# Altium project BIOWOLF.PrjPcb
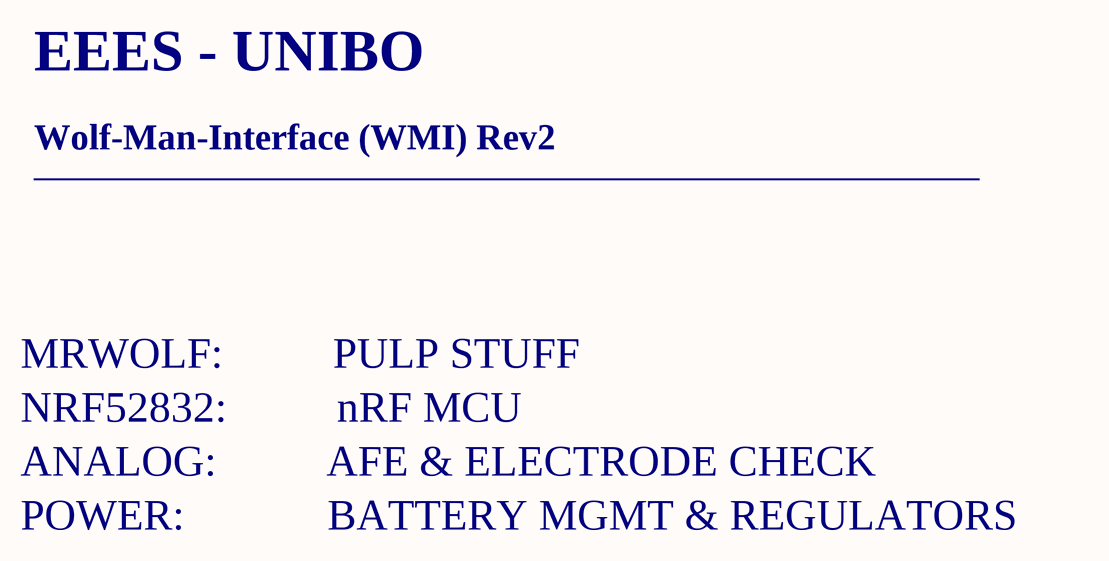
[diagram p0: 00_Cover.SchDoc]
7 sheets, 169 parts. Net scope: flat (ports and power ports of the same name join across sheets).
Board file: WOLFMAN.PcbDoc
Sheets:
  00_Cover.SchDoc
  01_MRWOLF.SchDoc
  02_NRF52832.SchDoc
  03_ANALOG_A.SchDoc
  04_ANALOG_B.SchDoc
  05_POWER.SchDoc
  06_SENSORS.SchDoc

## Sheet 00_Cover.SchDoc
size A4

### Notes on the sheet
- EEES - UNIBO
- Wolf-Man-Interface (WMI) Rev2
- ___________________________________________
- MRWOLF:          PULP STUFF
- NRF52832:          nRF MCU
- ANALOG:          AFE & ELECTRODE CHECK
- POWER:             BATTERY MGMT & REGULATORS

## Sheet 01_MRWOLF.SchDoc: WMI (MR.WOLF)
size A4; Author: MARCO; DrawnBy: MARCO; ProjectName: WOLF-MAN-INTERFACE
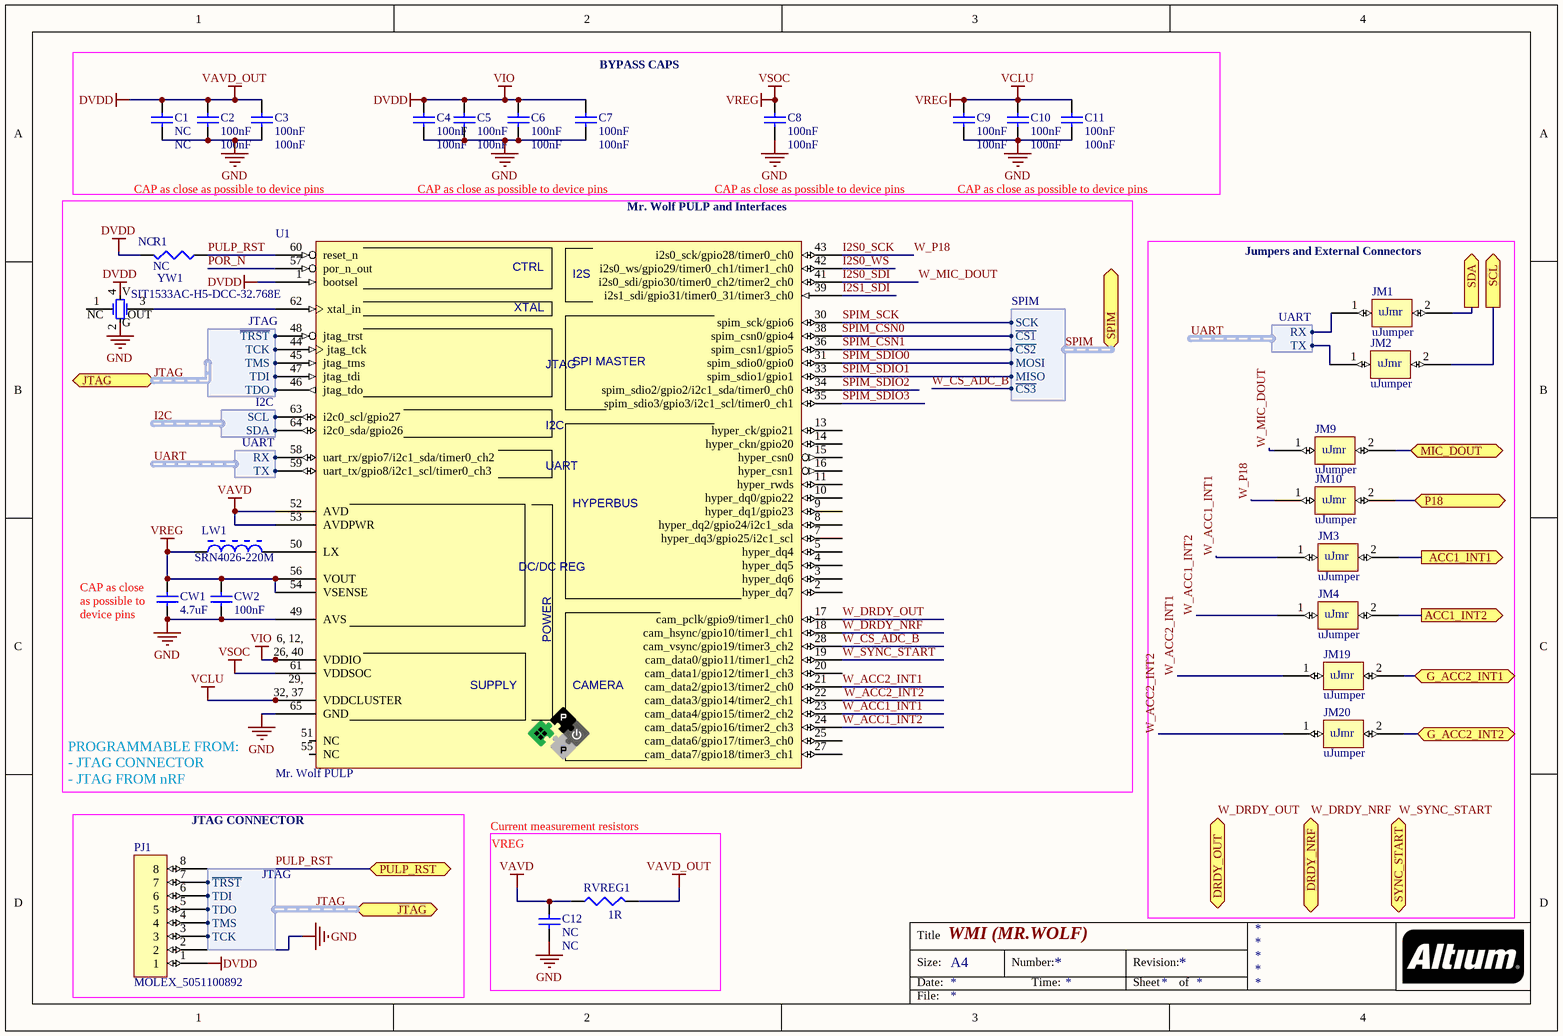
[diagram p1: 01_MRWOLF.SchDoc]

### Parts
C1  NC  [J1-0603]
C2  100nF  [0402]
C3  100nF  [0402]
C4  100nF  [0402]
C5  100nF  [0402]
C6  100nF  [0402]
C7  100nF  [0402]
C8  100nF  [0402]
C9  100nF  [0402]
C10  100nF  [0402]
C11  100nF  [0402]
C12  NC  [J1-0603]
CW1  4.7uF  [0402]
CW2  100nF  [0402]
JM1  uJumper  [UJMPR]
JM2  uJumper  [UJMPR]
JM3  uJumper  [UJMPR]
JM4  uJumper  [UJMPR]
JM9  uJumper  [UJMPR]
JM10  uJumper  [UJMPR]
JM19  uJumper  [UJMPR]
JM20  uJumper  [UJMPR]
LW1  SRN4026-220M  [1212_PCK]
PJ1  MOLEX_5051100892  [MOLEX_5051100892]
R1  NC  [0402]
RVREG1  value 1R  [J1-0603]
U1  Mr. Wolf PULP  [QFN50P900X900X100_HS_NOVIAS_65M]
YW1  SIT1533AC-H5-DCC-32.768E  [SiT1533-C]

### Blocks framed on the sheet
BYPASS CAPS: C1-C11
Mr. Wolf PULP and Interfaces: CW1 CW2 LW1 R1 U1 YW1
Jumpers and External Connectors: JM1-JM4 JM9 JM10 JM19 JM20
JTAG CONNECTOR: PJ1

### Ports
ACC1_INT1 (out), ACC1_INT2 (out), DRDY_NRF (bidir), DRDY_OUT (bidir), G_ACC2_INT1 (bidir), G_ACC2_INT2 (bidir), JTAG (harness JTAG), MIC_DOUT (bidir), P18 (bidir), PULP_RST (bidir), SCL (out), SDA (out), SPIM (harness SPIM), SYNC_START (bidir)

### Harnesses
JTAG: ~{TRST}, TCK, TMS, TDI, TDO
I2C: SCL, SDA
UART: RX, TX
SPIM: SCK, ~{CS1}, ~{CS2}, MOSI, MISO, ~{CS3}

### Nets
DVDD: C1.2 C2.2 C3.2 C4.2 C5.2 C6.2 C7.2 PJ1.1 R1.2 RVREG1.2 U1.1(bootsel) U1.6(VDDIO) U1.12(VDDIO) U1.26(VDDIO) U1.40(VDDIO) YW1.4(VDD)  [also labelled VAVD_OUT, VIO]
GND: C1.1 C2.1 C3.1 C4.1 C5.1 C6.1 C7.1 C8.1 C9.1 C10.1 C11.1 C12.1 CW1.1 CW2.1 PJ1.2 U1.49(AVS) U1.65(GND) YW1.2(GND)  [project net DGND]
VAVD: C12.2 RVREG1.1 U1.52(AVD) U1.53(AVDPWR)
VCLU: C8.2 C9.2 C10.2 C11.2 CW1.2 CW2.2 LW1.1 U1.29(VDDCLUSTER) U1.32(VDDCLUSTER) U1.37(VDDCLUSTER) U1.54(VSENSE) U1.56(VOUT) U1.61(VDDSOC)  [also labelled VREG, VSOC]
I2C.SCL: U1.63(i2c0_scl/gpio27) ; harness I2C.SCL
I2C.SDA: U1.64(i2c0_sda/gpio26) ; harness I2C.SDA
I2S0_SCK: JM10.1 U1.43(i2s0_sck/gpio28/timer0_ch0)  [also labelled W_P18]
I2S0_SDI: JM9.1 U1.41(i2s0_sdi/gpio30/timer0_ch2/timer2_ch0)  [also labelled W_MIC_DOUT]
I2S0_WS: U1.42(i2s0_ws/gpio29/timer0_ch1/timer1_ch0)
I2S1_SDI: U1.39(i2s1_sdi/gpio31/timer0_31/timer3_ch0)
JTAG.~{TRST}: PJ1.7 U1.48(jtag_trst) ; port JTAG.~{TRST}
JTAG.TCK: PJ1.3 U1.44(jtag_tck) ; port JTAG.TCK
JTAG.TDI: PJ1.6 U1.47(jtag_tdi) ; port JTAG.TDI
JTAG.TDO: PJ1.5 U1.46(jtag_tdo) ; port JTAG.TDO
JTAG.TMS: PJ1.4 U1.45(jtag_tms) ; port JTAG.TMS
P0.07: JM3.2 ; port ACC1_INT1
P0.08: JM4.2 ; port ACC1_INT2
P0.25: JM10.2 ; port P18
P0.27: JM9.2 ; port MIC_DOUT
P0.30/AIN6: JM1.2 ; port SDA
P0.31/AIN7: JM2.2 ; port SCL
POR_N: U1.57(por_n_out)
PULP_RST: PJ1.8 R1.1 U1.60(reset_n) ; port PULP_RST  [project net P0.29/AIN5]
SPIM_CSN0: U1.38(spim_csn0/gpio4) ; port SPIM.~{CS1}  [project net IN_CS_ADC_A]
SPIM_CSN1: U1.36(spim_csn1/gpio5) ; port SPIM.~{CS2}  [project net CS_nRF#]
SPIM_SCK: U1.30(spim_sck/gpio6) ; port SPIM.SCK  [project net SCK]
SPIM_SDIO0: U1.31(spim_sdio0/gpio0) ; port SPIM.MOSI  [project net MOSI]
SPIM_SDIO1: U1.33(spim_sdio1/gpio1) ; port SPIM.MISO  [project net MISO]
SPIM_SDIO2: U1.34(spim_sdio2/gpio2/i2c1_sda/timer0_ch0)
SPIM_SDIO3: U1.35(spim_sdio3/gpio3/i2c1_scl/timer0_ch1)
UART.RX: JM1.1 U1.58(uart_rx/gpio7/i2c1_sda/timer0_ch2) ; harness UART.RX
UART.TX: JM2.1 U1.59(uart_tx/gpio8/i2c1_scl/timer0_ch3) ; harness UART.TX
W_ACC1_INT1: JM3.1 U1.23(cam_data4/gpio15/timer2_ch2)
W_ACC1_INT2: JM4.1 U1.24(cam_data5/gpio16/timer2_ch3)
W_ACC2_INT1: JM19.1 U1.21(cam_data2/gpio13/timer2_ch0)
W_ACC2_INT2: JM20.1 U1.22(cam_data3/gpio14/timer2_ch1)
W_CS_ADC_B: U1.28(cam_vsync/gpio19/timer3_ch2) ; port SPIM.~{CS3}  [project net IN_CS_ADC_B]
W_DRDY_NRF: U1.18(cam_hsync/gpio10/timer1_ch1) ; port DRDY_NRF  [project net P0.20]
W_DRDY_OUT: U1.17(cam_pclk/gpio9/timer1_ch0) ; port DRDY_OUT  [project net P0.19]
W_SYNC_START: U1.19(cam_data0/gpio11/timer1_ch2) ; port SYNC_START  [project net P0.24]
NetJM11_2: JM19.2 ; port G_ACC2_INT1
NetJM18_2: JM20.2 ; port G_ACC2_INT2
NetLW1_2: LW1.2 U1.50(LX)
NetU1_62: U1.62(xtal_in) YW1.3(OUT)

Not connected (* = marked no-connect by the designer): U1 2(hyper_dq7) 3(hyper_dq6) 4(hyper_dq5) 5(hyper_dq4) 7(hyper_dq3/gpio25/i2c1_scl) 8(hyper_dq2/gpio24/i2c1_sda) 9(hyper_dq1/gpio23) 10(hyper_dq0/gpio22) 11(hyper_rwds) 13(hyper_ck/gpio21) 14(hyper_ckn/gpio20) 15(hyper_csn0) 16(hyper_csn1) 20(cam_data1/gpio12/timer1_ch3) 25(cam_data6/gpio17/timer3_ch0) 27(cam_data7/gpio18/timer3_ch1) 51(NC) 55(NC); YW1 1(NC)

### Buses and harness runs
harness JTAG = port JTAG
harness SPIM = port SPIM

### Notes on the sheet
- CAP as close as possible to device pins
- (near CW1) CAP as close as possible to device pins
- PROGRAMMABLE FROM:
  - JTAG CONNECTOR
  - JTAG FROM nRF
- Current measurement resistors
- VREG
- Title
- Size:
- Date:
- A4
- Number:
- Time:
- Revision:
- Sheet
- of
- File:
- (in symbol PULP_MR_WOLF) CTRL; I2S; XTAL; JTAG; SPI MASTER; I2C; UART; HYPERBUS; DC/DC REG; POWER; 6, 12,; 26, 40; 29,; SUPPLY; CAMERA; 32, 37
- (in symbol SIT-OSC32KHZ-SIT1533AC-H5-DCC-32.768) V; G
- (in symbol uJumper) uJmr

### Library data of the parts
C1-C12 = Cap Semi: Capacitor (Semiconductor SIM Model); Published: 8-Jun-2000; LatestRevisionDate: 29-May-2009; LatestRevisionNote: IPC-7351 Footprint Added.; PackageReference: C1206; Publisher: Altium Limited; PackageDescription: Chip Capacitor
  C1 C12: Value: NC
  C2-C11: Value: 100nF
CW1 CW2 = Cap Semi: Capacitor (Semiconductor SIM Model); Value: 100pF; Published: 8-Jun-2000; LatestRevisionDate: 29-May-2009; LatestRevisionNote: IPC-7351 Footprint Added.; PackageReference: C1206; Publisher: Altium Limited; PackageDescription: Chip Capacitor
LW1 = BOUR-IND-SRN4026-220M: Semi-shielded Power Inductor, 22uH, 3A; Manufacturer: Bourns; Core Material: Ferrite; Tolerance: 20%; Current Rating: 670mA; DC Resistance (DCR): 234mR; Self Resonant Frequency: 16MHz; Test Frequency: 100kHz; ComponentLink1URL: https://www.bourns.com/docs/Product-Datasheets/SRN4026.pdf; ComponentLink1Description: Datasheet; Supplier 1: RSComponents; Supplier Part Number 1: 813-5643P; Manufacturer Part Number: SRN4026-220M; Stock 1: 2770; Pricing 1: 100=0.209, 500=0.176, 3000=0.135, 6000=0.132 (EUR); Mount: Surface Mount; Case/Package: Nonstandard; Weight: 0.004938oz; Min Operating Temperature: -40°C; Max Operating Temperature: 125°C; Packaging: Tape and Reel; Composition: Wirewound; Inductance: 22uh; Saturation Current: 670mA; Shielding: Shielded; Max DC Current: 670mA; Termination: SMD/SMT; RMS Current (Irms): 670mA; Inductance Tolerance: 20%; Package Quantity: 3000; Length: 4mm; Height: 2.5mm; Width: 4mm; Height - Seated (Max): 0.098inch; Depth: 4mm; REACH SVHC: No SVHC; ComponentLink2URL: https://datasheet.ciiva.com/48684/srn4026-48684665.pdf; ComponentLink2Description: https://datasheet.ciiva.com/48684/srn4026-48684665.pdf; ComponentLink3URL: https://datasheet.ciiva.com/46641/70371276-46641103.pdf; ComponentLink3Description: https://datasheet.ciiva.com/46641/70371276-46641103.pdf; Supplier 2: Farnell; Supplier Part Number 2: 2428221; Stock 2: 402; Pricing 2: 5=0.298, 50=0.217, 250=0.175, 500=0.16, 1500=0.155, 3000=0.151, 15000=0.146 (EUR); Supplier 3: Digi-Key; Supplier Part Number 3: SRN4026-220MTR-ND; Stock 3: 0; Pricing 3: 3000=0.144, 6000=0.1395, 15000=0.135, 30000=0.133 (USD); Supplier 4: Digi-Key; Supplier Part Number 4: SRN4026-220MDKR-ND; Stock 4: 863; Pricing 4: 1=0.41, 10=0.362, 100=0.2588, 500=0.2174, 1000=0.176 (USD); Supplier 5: Mouser; Supplier Part Number 5: 652-SRN4026-220M; Stock 5: 140; Pricing 5: 1=0.36, 10=0.246, 50=0.246, 100=0.224, 1000=0.152, 10000=0.122 (USD); Supplier 6: Digi-Key; Supplier Part Number 6: SRN4026-220MCT-ND; Stock 6: 863; Pricing 6: 1=0.41, 10=0.362, 100=0.2588, 500=0.2174, 1000=0.176 (USD); Supplier 7: RSComponents; Supplier Part Number 7: 8135643; Stock 7: 1990; Pricing 7: 10=0.227, 100=0.216, 500=0.19, 3000=0.13, 6000=0.12 (GBP); Supplier 8: Distrelec; Supplier Part Number 8: SRN4026-220M; Stock 8: 3000; Pricing 8: 1=0.6667, 10=0.5, 100=0.3333, 500=0.2857 (EUR); Supplier 9: Farnell; Supplier Part Number 9: 2428221RL; Stock 9: 930; Pricing 9: 50=0.209, 250=0.165, 500=0.15, 1500=0.122, 3000=0.117, 15000=0.106, 30000=0.104 (GBP); Supplier 10: Distrelec; Supplier Part Number 10: 30026188; Stock 10: 2895; Pricing 10: 1=0.214, 10=0.1299, 50=0.1266, 250=0.1203, 500=0.1173, 2500=0.1145 (EUR); Supplier 11: RSComponents; Supplier Part Number 11: 813-5643; Stock 11: 2000; Pricing 11: 10=0.227, 100=0.216 (GBP)
R1 RVREG1 = Res3: Resistor; Published: 8-Jun-2000; LatestRevisionDate: 29-May-2009; LatestRevisionNote: IPC-7351 Footprint Added.; PackageReference: J1-0603; Publisher: Altium Limited; PackageDescription: Chip Resistor
  R1: Value: NC
U1 = PULP_MR_WOLF: Mr. Wolf PULP Heterogeneous Multi-Core System-On-Chip; Manufacturer: Aries Alectronics Inc.; Manufacturer Part Num: 23017; Part Class: Connectors; .checked_Footprint: 140604-11/scd; Num Pins: 64 (+9)
YW1 = SIT-OSC32KHZ-SIT1533AC-H5-DCC-32.768: 20 ppm, Ultra-Low Power 32.768 kHz Quartz XTAL Replacement; Current - Supply (max): 1.3uA; ComponentLink1URL: http://www.sitime.com/products/datasheets/sit1533/SiT1533-datasheet.pdf; ComponentLink1Description: Datasheet; Frequency: 32.768kHz; Supplier 1: Digi-Key; Supplier Part Number 1: 1473-1515-2-ND; Supplier 2: Digi-Key; Supplier Part Number 2: 1473-1515-1-ND; Supplier 3: Digi-Key; Supplier Part Number 3: 1473-1515-6-ND; Supplier 4: Digi-Key; Supplier Part Number 4: 1473-1516-2-ND; Supplier 5: Digi-Key; Supplier Part Number 5: 1473-1516-1-ND; Supplier 6: Digi-Key; Supplier Part Number 6: 1473-1516-6-ND; Supplier 7: Digi-Key; Supplier Part Number 7: SIT1533AC-H5-DCC-32.768S-ND; Supplier 8: Digi-Key; Supplier Part Number 8: SIT1533AC-H5-DCC-32.768D-ND

## Sheet 02_NRF52832.SchDoc: WMI (BLE)
size A4
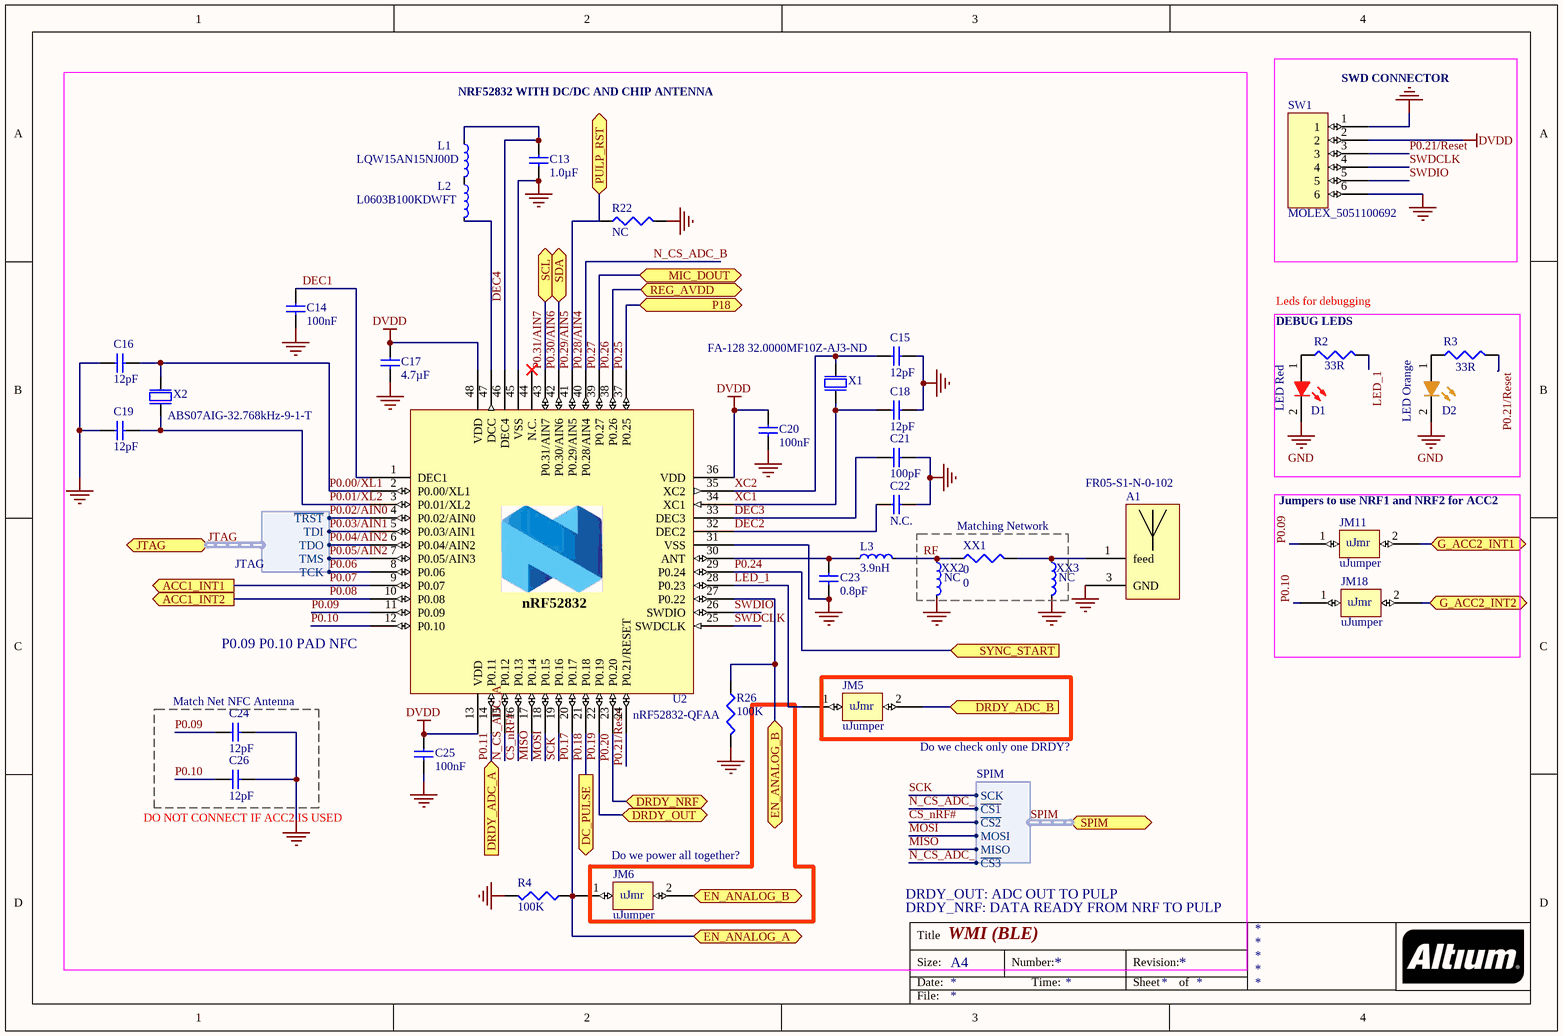
[diagram p2: 02_NRF52832.SchDoc]

### Parts
(Parts that share a designator on the sheet are numbered #1, #2 ... from top to bottom, then left to right.)
A1  FR05-S1-N-0-102  [DFN510P700X220-2N]
C13  1.0µF  [CAPC1608X06L]
C14  100nF  [CAPC1005X04L]
C15  12pF  [CAPC1005X04L]
C16  12pF  [CAPC1005X04L]
C17  4.7µF  [CAPC1608X06L]
C18  12pF  [CAPC1005X04L]
C19  12pF  [CAPC1005X04L]
C20  100nF  [CAPC1005X04L]
C21  100pF  [CAPC1005X04L]
C22  N.C.  [CAPC1005X04L]
C23  0.8pF  [CAPC1005X04L]
C24  12pF  [0402]
C25  100nF  [CAPC1005X04L]
C26  12pF  [0402]
D1  LED Red  [DIOC1608X08L]
D2  LED Orange  [DIOC1608X08L]
JM5  uJumper  [UJMPR]
JM6  uJumper  [UJMPR]
JM11  uJumper  [UJMPR]
JM18  uJumper  [UJMPR]
L1  LQW15AN15NJ00D  [INDC1005X04L]
L2  L0603B100KDWFT  [J1-0603]
L3  3.9nH  [INDC1005X04L]
R2  value 33R  [J1-0603]
R3  value 33R  [J1-0603]
R4  100K  [0402]
R22#1  NC  [0402]  (graphical)
R26  100K  [0402]
SW1  MOLEX_5051100692  [MOLEX_5051100692]
U2  nRF52832-QFAA  [QFN40P600X600X90-48N]
X1  FA-128 32.0000MF10Z-AJ3-ND  [BT-XTAL_2016]
X2  ABS07AIG-32.768kHz-9-1-T  [XTAL_3215]
XX1  0  [0402]
XX2  NC  [INDC1005X04L]
XX3  NC  [INDC1005X04L]

### Blocks framed on the sheet
SWD CONNECTOR: SW1
DEBUG LEDS: D1 D2 R2 R3
Jumpers to use NRF1 and NRF2 for ACC2: JM11 JM18
Matching Network: XX1-XX3
Match Net NFC Antenna: C24 C26

### Ports
ACC1_INT1 (out), ACC1_INT2 (out), DC_PULSE (out), DRDY_ADC_A (in), DRDY_ADC_B (in), DRDY_NRF (bidir), DRDY_OUT (bidir), EN_ANALOG_A (bidir), EN_ANALOG_B (bidir), G_ACC2_INT1 (bidir), G_ACC2_INT2 (bidir), JTAG (harness JTAG), MIC_DOUT (bidir), P18 (bidir), PULP_RST (bidir), REG_AVDD (bidir), SCL (bidir), SDA (bidir), SPIM (harness SPIM), SYNC_START (in)

### Harnesses
SPIM: SCK, ~{CS1}, ~{CS2}, MOSI, MISO, ~{CS3}
JTAG: ~{TRST}, TCK, TMS, TDI, TDO

### Nets
DVDD: C17.1 C20.1 C25.1 SW1.2 U2.13(VDD) U2.36(VDD) U2.48(VDD)
GND: A1.3(GND) C13.1 C14.2 C15.2 C16.2 C17.2 C18.2 C19.2 C20.2 C21.2 C22.1 C23.1 C24.1 C25.2 C26.1 D1.2(K) D2.2(K) R4.2 R22#1.2 R26.2 SW1.1 SW1.6 U2.31(VSS) U2.45(VSS) U2.49(GND) X1.2(GND) X1.4(GND) XX2.2 XX3.2  [project net DGND]
CS_nRF#: U2.16(P0.13) ; port SPIM.~{CS2}
DEC1: C14.1 U2.1(DEC1)
DEC2: C22.2 U2.32(DEC2)
DEC3: C21.1 U2.33(DEC3)
DEC4: C13.2 L1.1 U2.46(DEC4)
LED_1: JM5.1 R2.2 U2.28(P0.23)
MISO: U2.17(P0.14) ; port SPIM.MISO
MOSI: U2.18(P0.15) ; port SPIM.MOSI
N_CS_ADC_A: U2.15(P0.12) ; port SPIM.~{CS1}  [project net IN_CS_ADC_A]
N_CS_ADC_B: U2.40(P0.28/AIN4) ; port SPIM.~{CS3}  [also labelled P0.28/AIN4]  [project net IN_CS_ADC_B]
P0.00/XL1: C16.1 U2.2(P0.00/XL1) X2.1(inp)
P0.01/XL2: C19.1 U2.3(P0.01/XL2) X2.2(out)
P0.02/AIN0: U2.4(P0.02/AIN0) ; port JTAG.~{TRST}  [project net JTAG.~{TRST}]
P0.03/AIN1: U2.5(P0.03/AIN1) ; port JTAG.TDI  [project net JTAG.TDI]
P0.04/AIN2: U2.6(P0.04/AIN2) ; port JTAG.TDO  [project net JTAG.TDO]
P0.05/AIN2: U2.7(P0.05/AIN3) ; port JTAG.TMS  [project net JTAG.TMS]
P0.06: U2.8(P0.06) ; port JTAG.TCK  [project net JTAG.TCK]
P0.07: U2.9(P0.07) ; port ACC1_INT1
P0.08: U2.10(P0.08) ; port ACC1_INT2
P0.09: C24.2 JM11.1 U2.11(P0.09)
P0.10: C26.2 JM18.1 U2.12(P0.10)
P0.11: U2.14(P0.11) ; port DRDY_ADC_A
P0.17: JM6.1 R4.1 U2.20(P0.17) ; port EN_ANALOG_A
P0.18: U2.21(P0.18) ; port DC_PULSE
P0.19: U2.22(P0.19) ; port DRDY_OUT
P0.20: U2.23(P0.20) ; port DRDY_NRF
P0.21/Reset: R3.2 SW1.3 U2.24(P0.21/RESET)
P0.24: U2.29(P0.24) ; port SYNC_START
P0.25: U2.37(P0.25) ; port P18
P0.26: U2.38(P0.26) ; port REG_AVDD
P0.27: U2.39(P0.27) ; port MIC_DOUT
P0.29/AIN5: R22#1.1 U2.41(P0.29/AIN5) ; port PULP_RST
P0.30/AIN6: U2.42(P0.30/AIN6) ; port SDA
P0.31/AIN7: U2.43(P0.31/AIN7) ; port SCL
RF: L3.2 XX1.1 XX2.1
SCK: U2.19(P0.16) ; port SPIM.SCK
SWDCLK: SW1.4 U2.25(SWDCLK)
SWDIO: SW1.5 U2.26(SWDIO)
XC1: C18.1 U2.34(XC1) X1.1(inp)
XC2: C15.1 U2.35(XC2) X1.3(out)
NetA1_1: A1.1(feed) XX1.2 XX3.1
NetADC2_35: JM6.2 R26.1 U2.27(P0.22) ; port EN_ANALOG_B
NetADC2_47: JM5.2 ; port DRDY_ADC_B
NetC23_2: C23.2 L3.1 U2.30(ANT)
NetD1_1: D1.1(A) R2.1
NetD2_1: D2.1(A) R3.1
NetJM11_2: JM11.2 ; port G_ACC2_INT1
NetJM18_2: JM18.2 ; port G_ACC2_INT2
NetL1_2: L1.2 L2.1
NetL2_2: L2.2 U2.47(DCC)

Not connected (* = marked no-connect by the designer): A1 2(not_connected); U2 44(N.C.)*

### Buses and harness runs
harness JTAG = port JTAG
harness SPIM = port SPIM

### Notes on the sheet
- NRF52832 WITH DC/DC AND CHIP ANTENNA
- Leds for debugging
- P0.09 P0.10 PAD NFC
- (near JM5) Do we check only one DRDY?
- (near C26) DO NOT CONNECT IF ACC2 IS USED
- (near JM6) Do we power all together?
- DRDY_OUT: ADC OUT TO PULP
- DRDY_NRF: DATA READY FROM NRF TO PULP
- Title
- Size:
- Date:
- A4
- Number:
- Time:
- Revision:
- Sheet
- of
- File:
- (in symbol nRF52832-QFAB) nRF52832
- (in symbol uJumper) uJmr

### Library data of the parts
A1 = FR05-S1-N-0-102: Bluetooth antenna
C13 = C0603-1µ0: Capacitor, X7R, ±10%; Note: 16V; Artikkelnr Noca: 20039335; Artikkelnr Simpro: N.A.; Part Number: C0603-1µ0; Manufacturer: *; Manufacturer Part Number: *; Datasheet: *; LatestRevisionDate: 2013-06-05; Pin Count: 2; Publisher: Nordic Semiconductor; Published: 2009-05-08; Value: 1.0µF; Supplier: *; Supplier part number: *; 2nd source Supplier: *; 2nd source part number: *; Footprint Doc: 0603
C14 C20 C25 = C0402-100n: Capacitor, X7R, ±10%; Note: 16V; Artikkelnr Noca: 20039200; Artikkelnr Simpro: N.A.; Part Number: C0402-100n; Manufacturer: *; Manufacturer Part Number: *; Datasheet: *; LatestRevisionDate: 2009-11-23; Pin Count: 2; Publisher: Nordic Semiconductor; Published: 2009-05-08; Value: 100nF; Supplier: *; Supplier part number: *; 2nd source Supplier: *; 2nd source part number: *; Footprint Doc: 0402
C15 C16 C18 C19 C24 C26 = C0402-12p: Capacitor, NP0, ±2%; Note: 50V; Artikkelnr Noca: 20029159; Artikkelnr Simpro: N.A.; Part Number: C0402-12p; Manufacturer: *; Manufacturer Part Number: *; Datasheet: *; LatestRevisionDate: 2011-05-11; Pin Count: 2; Publisher: Nordic Semiconductor; Published: 2009-05-08; Value: 12pF; Supplier: *; Supplier part number: *; 2nd source Supplier: *; 2nd source part number: *; Footprint Doc: 0402
C17 = C0603-4µ7: Capacitor, X5R, ±10%; Note: 6.3V; Artikkelnr Noca: 20069060; Artikkelnr Simpro: N.A.; Part Number: C0603-4µ7; Manufacturer: *; Manufacturer Part Number: *; Datasheet: *; LatestRevisionDate: 2009-11-23; Pin Count: 2; Publisher: Nordic Semiconductor; Published: 2009-05-08; Value: 4.7µF; Supplier: *; Supplier part number: *; 2nd source Supplier: *; 2nd source part number: *; Footprint Doc: 0603
C21 = C0402-100p: Capacitor, NP0, ±5%; Note: 50V; Artikkelnr Noca: 20029135; Artikkelnr Simpro: N.A.; Part Number: C0402-100p; Manufacturer: *; Manufacturer Part Number: *; Datasheet: *; LatestRevisionDate: 2009-05-08; Pin Count: 2; Publisher: Nordic Semiconductor; Published: 2009-05-08; Value: 100pF; Supplier: *; Supplier part number: *; 2nd source Supplier: *; 2nd source part number: *; Footprint Doc: 0402
C22 = C0402-N.C.: Not mounted; Note: Chip Cap; Artikkelnr Noca: N.A.; Part Number: C0402-N.C.; Manufacturer: *; Manufacturer Part Number: *; Datasheet: *; LatestRevisionDate: 2009-05-08; Pin Count: 2; Publisher: Nordic Semiconductor; Published: 2009-05-08; Value: N.C.; Supplier: *; Supplier part number: *; 2nd source Supplier: *; 2nd source part number: *; Footprint Doc: 0402; Artikkelnr Simpro: N.A.
C23 = C0402-0.8p: Capacitor, NP0, ±5%; Note: 50V; Artikkelnr Noca: 20029147; Artikkelnr Simpro: N.A.; Part Number: C0402-0.8p; Manufacturer: *; Manufacturer Part Number: *; Datasheet: *; LatestRevisionDate: 2012-11-21; Pin Count: 2; Publisher: Nordic Semiconductor; Published: 2009-05-08; Value: 0.8pF; Supplier: *; Supplier part number: *; 2nd source Supplier: *; 2nd source part number: *; Footprint Doc: 0402
D1 = KING-LED-RED-APT1608LSECK/J3-PRV: 1.6X0.8mm SMD CHIP LED LAMP, Hyper Red; Part Number: APT1608LSECK/J4-PRV; Forward Voltage: 1.8V; Test Current: 2mA; ComponentLink1Description: Datasheet; ComponentLink1URL: http://www.kingbrightusa.com/images/catalog/SPEC/APT1608LSECK-J3-PRV.pdf; Supplier 1: Digi-Key; Supplier 2: Mouser; Supplier 3: Digi-Key; Supplier 4: Digi-Key; Supplier Part Number 1: 754-1930-6-ND; Supplier Part Number 2: 604-APT1608LSECKJ3RV; Supplier Part Number 3: 754-1930-1-ND; Supplier Part Number 4: 754-1930-2-ND
D2 = KING-LED-ORANGE-APT1608LSECK/J4-PRV: 1.6X0.8mm SMD CHIP LED LAMP, Super Bright Orange; Forward Voltage: 1.8V; Test Current: 2mA; Part Number: APT1608LSECK/J4-PRV; ComponentLink1Description: Datasheet; ComponentLink1URL: http://www.kingbrightusa.com/images/catalog/SPEC/APT1608LSECK-J4-PRV.pdf; Supplier 1: Digi-Key; Supplier 2: Digi-Key; Supplier 3: Mouser; Supplier 4: Digi-Key; Supplier Part Number 1: 754-1931-6-ND; Supplier Part Number 2: 754-1931-1-ND; Supplier Part Number 3: 604-APT1608LSECKJ4RV; Supplier Part Number 4: 754-1931-2-ND
L1 = L0402-15n: High frequency chip inductor ±10%; Manufacturer: Taiyo Yuden; Manufacturer Part Number: HK100515NJ-T; 2nd source part number: 658-1328; Value: 15nH; Artikkelnr Noca: 33029323; Artikkelnr Simpro: N.A.; Part Number: L0402-15n; LatestRevisionDate: 2012-09-19; Pin Count: 2; Publisher: Nordic Semiconductor; Published: 2010-07-12; Note: High frequency chip inductor ±10%; Supplier: Digi-Key; Datasheet: http://www.yuden.co.jp/productdata/catalog/en/mlci04_e.pdf; Supplier part number: 587-1521-1-ND; 2nd source Supplier: Farnell; Footprint Doc: 0402
L2 = L0603-10µ: Chip inductor, IDC,min = 50 mA, ±20%; Manufacturer: Taiyo Yuden; Manufacturer Part Number: LBMF1608T100K; 2nd source part number: 178-6105; Value: 10µH; Note: LBMF1608T100K 10µH 80mA 0603; Artikkelnr Noca: 33029314; Artikkelnr Simpro: N.A.; Part Number: L0603-10µ; Datasheet: http://www.yuden.co.jp/ut/product/pdf/elb2_e.pdf; LatestRevisionDate: 2012-09-19; Pin Count: 2; Publisher: Nordic Semiconductor; Published: 2010-02-24; Supplier: Digi-Key; Supplier part number: 587-1714-1-ND; 2nd source Supplier: Farnell; Footprint Doc: 0603
L3 = L0402-3n9: High frequency chip inductor ±5%; Manufacturer: Murata; Manufacturer Part Number: LQP15MN3N9B02D; Artikkelnr Noca: 33029151; Artikkelnr Simpro: N.A.; Part Number: L0402-3n9; Datasheet: http://search.murata.co.jp/Ceramy/image/img/PDF/ENG/L0075S0084LQP15M.pdf; LatestRevisionDate: 2012-09-19; Pin Count: 2; Publisher: Nordic Semiconductor; Published: 2009-05-08; Value: 3.9nH; Note: High frequency chip inductor ±5%; Supplier: Digi-Key; Supplier part number: 490-1131-1-ND; 2nd source Supplier: *; 2nd source part number: *; Footprint Doc: 0402
R2-R4 R22#1 R26 XX1 = Res3: Resistor; Published: 8-Jun-2000; LatestRevisionDate: 29-May-2009; LatestRevisionNote: IPC-7351 Footprint Added.; PackageReference: J1-0603; Publisher: Altium Limited; PackageDescription: Chip Resistor
  R4 R26: Value: 100K
  R22#1: Value: NC
  XX1: Value: 0
U2 = nRF52832-QFAB: Multi-protocol Bluetooth Low Energy, ANT and 2.4GHz proprietary system-on-chip; Manufacturer: Nordic Semiconductor; Artikkelnr Noca: N.A.; Part Number: nRF52832-QFAA; Manufacturer Part Number: nRF52832-QFAA; Datasheet: *; LatestRevisionDate: 2016-11-24; Pin Count: 48; Publisher: Nordic Semiconductor; Published: 2016-11-24; Value: nRF52832-QFAA; Note: *; Supplier: Nordic Semiconductor; Supplier part number: *; 2nd source Supplier: *; 2nd source part number: *; Footprint Doc: QFN-48; Artikkelnr Simpro: N.A.
X1 = XTAL_SMD2016_32MHz_8pF_General: XTAL SMD 2016, 32MHz, Cl=8pF, Total Tol: ±40ppm; Note: XTAL SMD 32.000MHz; Artikkelnr Noca: N.A.; Part Number: XTAL_SMD2016_32MHz_8pF_General; Manufacturer: *; Manufacturer Part Number: *; Datasheet: *; LatestRevisionDate: 2016-08-19; Pin Count: 4; Publisher: Nordic Semiconductor; Published: 2016-08-19; Value: 32MHz; Supplier: *; Supplier part number: *; 2nd source Supplier: *; 2nd source part number: *; Footprint Doc: XTAL_2016; Artikkelnr Simpro: N.A.
X2 = XTAL_SMD3215_32.768kHz_9pF_General: XTAL SMD 3215, 32.768kHz, Cl=9pF, Total Tol: ±50ppm; Note: XTAL SMD 32.768kHz; Artikkelnr Noca: N.A.; Part Number: XTAL_SMD3215_32.768kHz_9pF_General; Manufacturer: *; Manufacturer Part Number: *; Datasheet: *; LatestRevisionDate: 2016-08-19; Pin Count: 2; Publisher: Nordic Semiconductor; Published: 2016-08-19; Value: 32.768kHz; Supplier: *; Supplier part number: *; 2nd source Supplier: *; 2nd source part number: *; Footprint Doc: XTAL_3215; Artikkelnr Simpro: N.A.
XX2 XX3 = L0402-N.C.: Not mounted; Value: N.C.; Artikkelnr Noca: N.A.; Assembly: Not mounted; Part Number: L0402-N.C.; Manufacturer: *; Manufacturer Part Number: *; Datasheet: *; LatestRevisionDate: 2016-11-24; Pin Count: 2; Publisher: Nordic Semiconductor; Published: 2016-11-24; Note: *; Supplier: *; Supplier part number: *; 2nd source Supplier: *; 2nd source part number: *; Footprint Doc: 0402; Artikkelnr Simpro: N.A.; ComponentLink1Description: Datasheet; ComponentLink2Description: Supplier link

## Sheet 03_ANALOG_A.SchDoc: WMI (AFE)
size A4
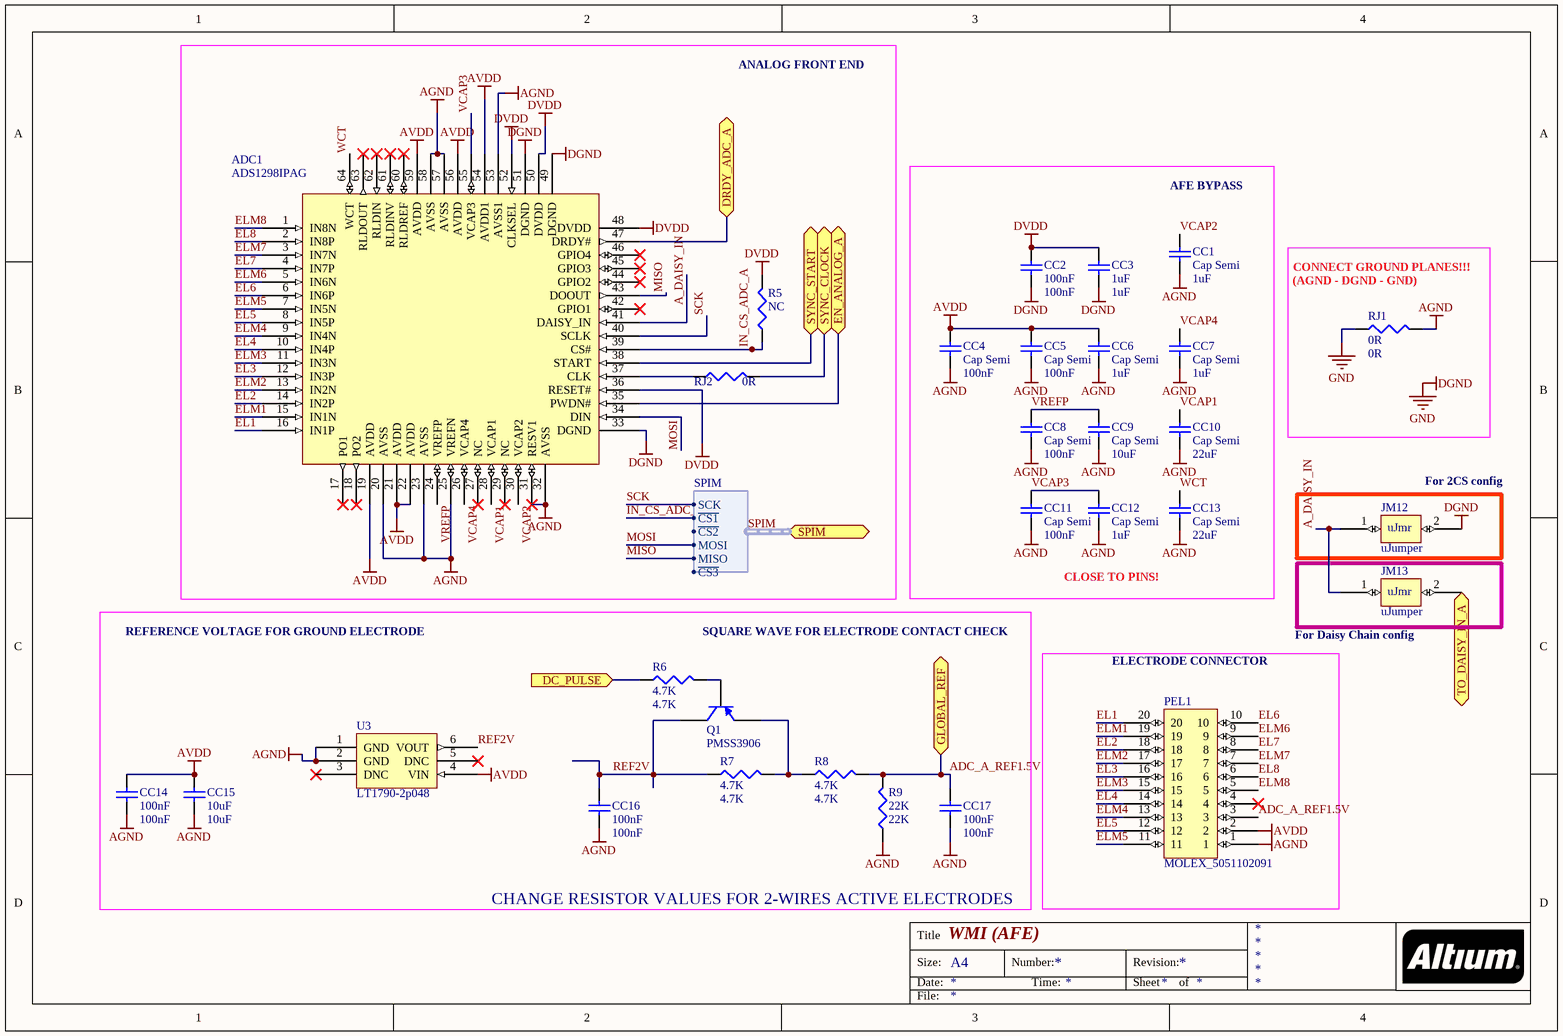
[diagram p3: 03_ANALOG_A.SchDoc]

### Parts
ADC1  ADS1298IPAG  [LQFP64_M]
CC1  Cap Semi  value 1uF  [0402]
CC2  100nF  [0402]
CC3  1uF  [0402]
CC4  Cap Semi  value 100nF  [0402]
CC5  Cap Semi  value 100nF  [0402]
CC6  Cap Semi  value 1uF  [0402]
CC7  Cap Semi  value 1uF  [0402]
CC8  Cap Semi  value 100nF  [0402]
CC9  Cap Semi  value 10uF  [0402]
CC10  Cap Semi  value 22uF  [J1-0603]
CC11  Cap Semi  value 100nF  [0402]
CC12  Cap Semi  value 1uF  [0402]
CC13  Cap Semi  value 22uF  [1608[0603]]
CC14  100nF  [0402]
CC15  10uF  [0402]
CC16  100nF  [0402]
CC17  100nF  [0402]
JM12  uJumper  [UJMPR]
JM13  uJumper  [UJMPR]
PEL1  MOLEX_5051102091  [MOLEX_5051102091]
Q1  PMSS3906  [SOT323_N]
R5  NC  [0402]
R6  4.7K  [0402]
R7  4.7K  [0402]
R8  4.7K  [0402]
R9  22K  [0402]
RJ1  0R  [0402]
RJ2  0R  [0402]
U3  LT1790-2p048  [SOT-23_A_N]

### Blocks framed on the sheet
ANALOG FRONT END: ADC1 R5 RJ2
For 2CS config: JM12
CHANGE RESISTOR VALUES FOR 2-WIRES ACTIVE ELECTRODES: CC14-CC17 Q1 R6-R9 U3
ELECTRODE CONNECTOR: PEL1

### Ports
DC_PULSE (in), DRDY_ADC_A (bidir), EN_ANALOG_A (bidir), GLOBAL_REF (bidir), SPIM (harness SPIM), SYNC_CLOCK (bidir), SYNC_START (bidir), TO_DAISY_IN_A (bidir)

### Harnesses
SPIM: SCK, ~{CS1}, ~{CS2}, MOSI, MISO, ~{CS3}

### Nets
AGND: ADC1.20(AVSS) ADC1.23(AVSS) ADC1.25(VREFN) ADC1.31(RESV1) ADC1.32(AVSS) ADC1.53(AVSS1) ADC1.57(AVSS) ADC1.58(AVSS) CC1.1 CC4.1 CC5.1 CC6.1 CC7.1 CC8.1 CC9.1 CC10.1 CC11.1 CC12.1 CC13.1 CC14.1 CC15.1 CC16.1 CC17.1 PEL1.1 R9.1 RJ1.2 U3.1(GND) U3.2(GND)
AVDD: ADC1.19(AVDD) ADC1.21(AVDD) ADC1.22(AVDD) ADC1.54(AVDD1) ADC1.56(AVDD) ADC1.59(AVDD) CC4.2 CC5.2 CC6.2 CC14.2 CC15.2 PEL1.2 U3.4(VIN)
DGND: ADC1.33(DGND) ADC1.49(DGND) ADC1.51(DGND) CC2.1 CC3.1 JM12.2 RJ1.1  [also labelled GND]
DVDD: ADC1.36(RESET#) ADC1.48(DVDD) ADC1.50(DVDD) ADC1.52(CLKSEL) CC2.2 CC3.2 R5.2
A_DAISY_IN: ADC1.41(DAISY_IN) JM12.1 JM13.1
ADC_A_REF1.5V: CC17.2 PEL1.3 R8.2 R9.2 ; port GLOBAL_REF
EL1: ADC1.16(IN1P) PEL1.20
EL2: ADC1.14(IN2P) PEL1.18
EL3: ADC1.12(IN3P) PEL1.16
EL4: ADC1.10(IN4P) PEL1.14
EL5: ADC1.8(IN5P) PEL1.12
EL6: ADC1.6(IN6P) PEL1.10
EL7: ADC1.4(IN7P) PEL1.8
EL8: ADC1.2(IN8P) PEL1.6
ELM1: ADC1.15(IN1N) PEL1.19
ELM2: ADC1.13(IN2N) PEL1.17
ELM3: ADC1.11(IN3N) PEL1.15
ELM4: ADC1.9(IN4N) PEL1.13
ELM5: ADC1.7(IN5N) PEL1.11
ELM6: ADC1.5(IN6N) PEL1.9
ELM7: ADC1.3(IN7N) PEL1.7
ELM8: ADC1.1(IN8N) PEL1.5
IN_CS_ADC_A: ADC1.39(CS#) R5.1 ; port SPIM.~{CS1}
MISO: ADC1.43(DOOUT) ; port SPIM.MISO
MOSI: ADC1.34(DIN) ; port SPIM.MOSI
P0.11: ADC1.47(DRDY#) ; port DRDY_ADC_A
P0.17: ADC1.35(PWDN#) ; port EN_ANALOG_A
P0.18: R6.1 ; port DC_PULSE
P0.24: ADC1.38(START) ; port SYNC_START
REF2V: CC16.2 Q1.3(C) R7.1 U3.6(VOUT)
SCK: ADC1.40(SCLK) ; port SPIM.SCK
VCAP1: ADC1.28(VCAP1) CC10.2
VCAP2: ADC1.30(VCAP2) CC1.2
VCAP3: ADC1.55(VCAP3) CC11.2 CC12.2
VCAP4: ADC1.26(VCAP4) CC7.2
VREFP: ADC1.24(VREFP) CC8.2 CC9.2
WCT: ADC1.64(WCT) CC13.2
NetADC1_37: ADC1.37(CLK) RJ2.1
NetADC2_37: RJ2.2 ; port SYNC_CLOCK
NetJM13_2: JM13.2 ; port TO_DAISY_IN_A
NetQ1_1: Q1.1(B) R6.2
NetQ1_2: Q1.2(E) R7.2 R8.1

Not connected (* = marked no-connect by the designer): ADC1 17(PO1)* 18(PO2)* 27(NC)* 29(NC)* 42(GPIO1)* 44(GPIO2)* 45(GPIO3)* 46(GPIO4)* 60(RLDREF)* 61(RLDINV)* 62(RLDIN)* 63(RLDOUT)*; PEL1 4*; U3 3(DNC)* 5(DNC)*

### Buses and harness runs
harness SPIM = port SPIM

### Notes on the sheet
- AFE BYPASS
- (near RJ1) (AGND - DGND - GND)
- CONNECT GROUND PLANES!!!
- CLOSE TO PINS!
- REFERENCE VOLTAGE FOR GROUND ELECTRODE
- SQUARE WAVE FOR ELECTRODE CONTACT CHECK
- (near JM13) For Daisy Chain config
- Title
- Size:
- Date:
- A4
- Number:
- Time:
- Revision:
- Sheet
- of
- File:
- (in symbol uJumper) uJmr

### Library data of the parts
ADC1 = ADS1298
CC1-CC17 = Cap Semi: Capacitor (Semiconductor SIM Model); Published: 8-Jun-2000; LatestRevisionDate: 29-May-2009; LatestRevisionNote: IPC-7351 Footprint Added.; PackageReference: C1206; Publisher: Altium Limited; PackageDescription: Chip Capacitor
  CC2 CC14 CC16 CC17: Value: 100nF
  CC3: Value: 1uF
  CC15: Value: 10uF
Q1 = PMSS3906: PNP Switching Transistor; Published: 17-Sep-2003; LatestRevisionDate: 12-Dec-2006; LatestRevisionNote: IPC-7351 Footprint Added.; DatasheetVersion: 22-Apr-1999; PackageVersion: Apr-1999; PackageReference: SOT323; Publisher: Altium Limited; PackageDescription: 3-Pin SOT-323 Package 0.65 mm Pitch, 2.1 mm Lead Span; ComponentLink1Description: Manufacturer Link; ComponentLink1URL: http://www.semiconductors.philips.com/; ComponentLink2Description: Datasheet; ComponentLink2URL: http://www.semiconductors.philips.com/acrobat/datasheets/PMSS3906_4.pdf
R5-R9 RJ1 RJ2 = Res3: Resistor; Published: 8-Jun-2000; LatestRevisionDate: 29-May-2009; LatestRevisionNote: IPC-7351 Footprint Added.; PackageReference: J1-0603; Publisher: Altium Limited; PackageDescription: Chip Resistor
  R5: Value: NC
  R6-R8: Value: 4.7K
  R9: Value: 22K
  RJ1 RJ2: Value: 0R
U3 = LT1790

## Sheet 04_ANALOG_B.SchDoc
size A4
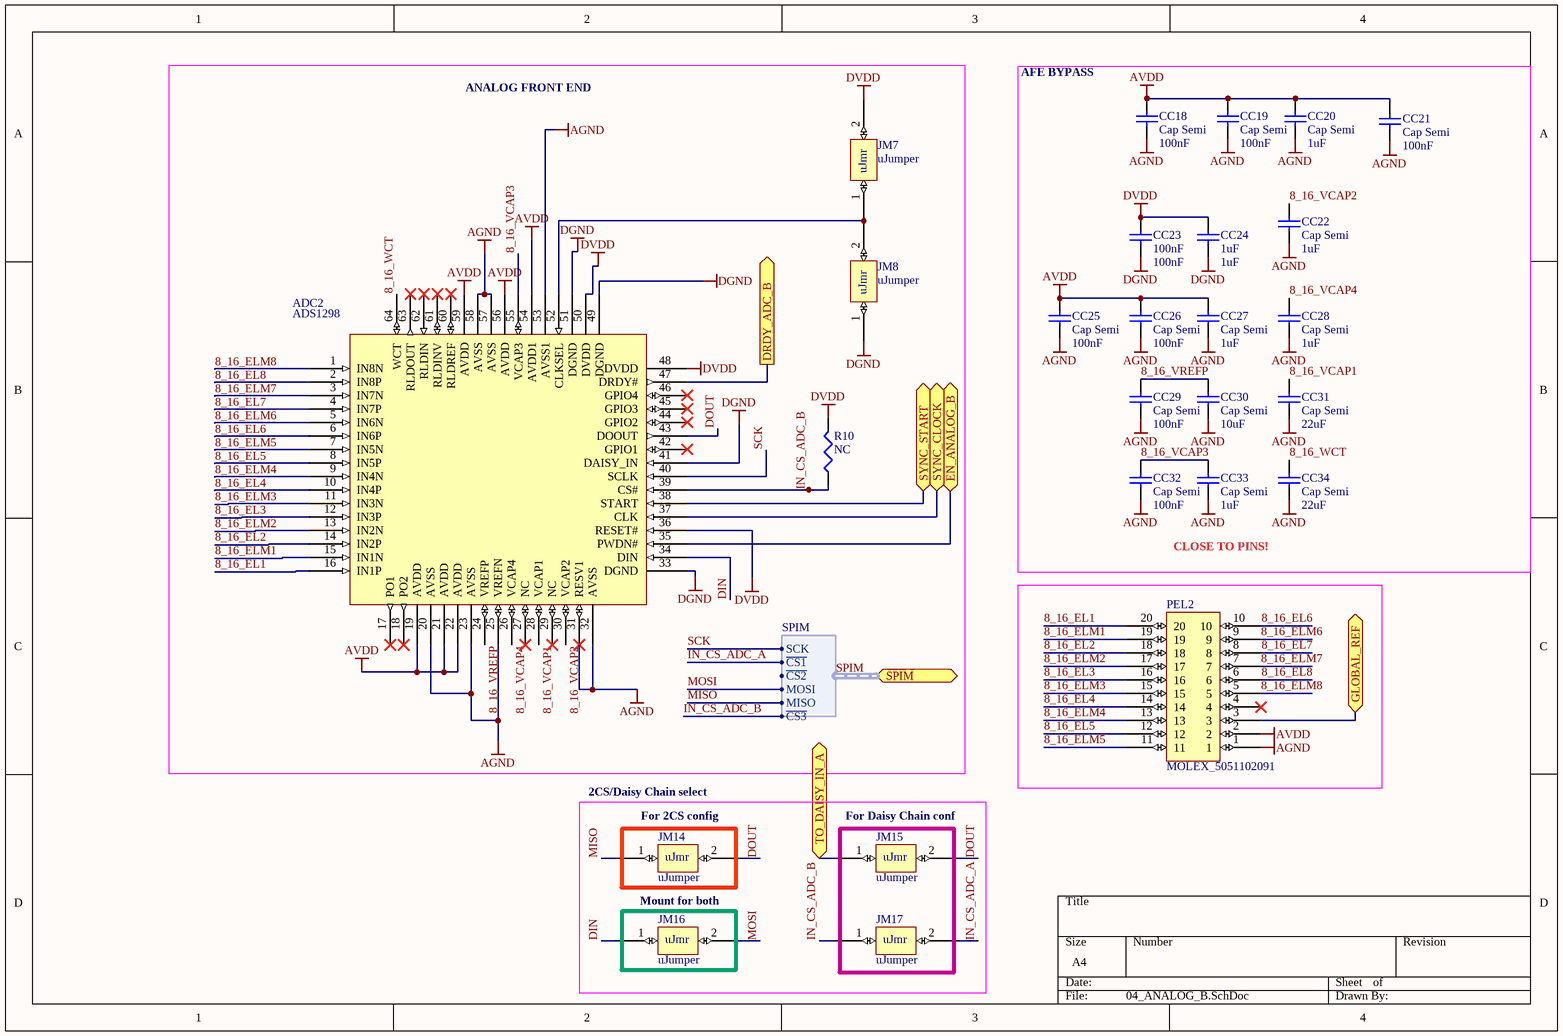
[diagram p4: 04_ANALOG_B.SchDoc]

### Parts
ADC2  ADS1298  [S-PQFP - G64 - ADS1298]
CC18  Cap Semi  value 100nF  [0402]
CC19  Cap Semi  value 100nF  [0402]
CC20  Cap Semi  value 1uF  [0402]
CC21  Cap Semi  value 100nF  [0402]
CC22  Cap Semi  value 1uF  [0402]
CC23  100nF  [0402]
CC24  1uF  [0402]
CC25  Cap Semi  value 100nF  [0402]
CC26  Cap Semi  value 100nF  [0402]
CC27  Cap Semi  value 1uF  [0402]
CC28  Cap Semi  value 1uF  [0402]
CC29  Cap Semi  value 100nF  [0402]
CC30  Cap Semi  value 10uF  [0402]
CC31  Cap Semi  value 22uF  [J1-0603]
CC32  Cap Semi  value 100nF  [0402]
CC33  Cap Semi  value 1uF  [0402]
CC34  Cap Semi  value 22uF  [1608[0603]]
JM7  uJumper  [UJMPR]
JM8  uJumper  [UJMPR]
JM14  uJumper  [UJMPR]
JM15  uJumper  [UJMPR]
JM16  uJumper  [UJMPR]
JM17  uJumper  [UJMPR]
PEL2  MOLEX_5051102091  [MOLEX_5051102091]
R10  NC  [0402]

### Blocks framed on the sheet
ANALOG FRONT END: ADC2 JM7 JM8 R10
For 2CS config: JM14
For Daisy Chain conf: JM15 JM17
Mount for both: JM16

### Ports
DRDY_ADC_B (out), EN_ANALOG_B (bidir), GLOBAL_REF (bidir), SPIM (harness SPIM), SYNC_CLOCK (bidir), SYNC_START (bidir), TO_DAISY_IN_A (bidir)

### Harnesses
SPIM: SCK, ~{CS1}, ~{CS2}, MOSI, MISO, ~{CS3}

### Nets
AGND: ADC2.20(AVSS) ADC2.23(AVSS) ADC2.25(VREFN) ADC2.31(RESV1) ADC2.32(AVSS) ADC2.53(AVSS1) ADC2.57(AVSS) ADC2.58(AVSS) CC18.1 CC19.1 CC20.1 CC21.1 CC22.1 CC25.1 CC26.1 CC27.1 CC28.1 CC29.1 CC30.1 CC31.1 CC32.1 CC33.1 CC34.1 PEL2.1
AVDD: ADC2.19(AVDD) ADC2.21(AVDD) ADC2.22(AVDD) ADC2.54(AVDD1) ADC2.56(AVDD) ADC2.59(AVDD) CC18.2 CC19.2 CC20.2 CC21.2 CC25.2 CC26.2 CC27.2 PEL2.2
DGND: ADC2.33(DGND) ADC2.41(DAISY_IN) ADC2.49(DGND) ADC2.51(DGND) CC23.1 CC24.1 JM8.1
DVDD: ADC2.36(RESET#) ADC2.48(DVDD) ADC2.50(DVDD) CC23.2 CC24.2 JM7.2 R10.2
8_16_EL1: ADC2.16(IN1P) PEL2.20
8_16_EL2: ADC2.14(IN2P) PEL2.18
8_16_EL3: ADC2.12(IN3P) PEL2.16
8_16_EL4: ADC2.10(IN4P) PEL2.14
8_16_EL5: ADC2.8(IN5P) PEL2.12
8_16_EL6: ADC2.6(IN6P) PEL2.10
8_16_EL7: ADC2.4(IN7P) PEL2.8
8_16_EL8: ADC2.2(IN8P) PEL2.6
8_16_ELM1: ADC2.15(IN1N) PEL2.19
8_16_ELM2: ADC2.13(IN2N) PEL2.17
8_16_ELM3: ADC2.11(IN3N) PEL2.15
8_16_ELM4: ADC2.9(IN4N) PEL2.13
8_16_ELM5: ADC2.7(IN5N) PEL2.11
8_16_ELM6: ADC2.5(IN6N) PEL2.9
8_16_ELM7: ADC2.3(IN7N) PEL2.7
8_16_ELM8: ADC2.1(IN8N) PEL2.5
8_16_VCAP1: ADC2.28(VCAP1) CC31.2
8_16_VCAP2: ADC2.30(VCAP2) CC22.2
8_16_VCAP3: ADC2.55(VCAP3) CC32.2 CC33.2
8_16_VCAP4: ADC2.26(VCAP4) CC28.2
8_16_VREFP: ADC2.24(VREFP) CC29.2 CC30.2
8_16_WCT: ADC2.64(WCT) CC34.2
ADC_A_REF1.5V: PEL2.3 ; port GLOBAL_REF
DIN: ADC2.34(DIN) JM16.1
DOUT: ADC2.43(DOOUT) JM14.2 JM15.2
IN_CS_ADC_A: JM17.2 ; port SPIM.~{CS1}
IN_CS_ADC_B: ADC2.39(CS#) JM17.1 R10.1 ; port SPIM.~{CS3}
MISO: JM14.1 ; port SPIM.MISO
MOSI: JM16.2 ; port SPIM.MOSI
P0.24: ADC2.38(START) ; port SYNC_START
SCK: ADC2.40(SCLK) ; port SPIM.SCK
NetADC2_35: ADC2.35(PWDN#) ; port EN_ANALOG_B
NetADC2_37: ADC2.37(CLK) ; port SYNC_CLOCK
NetADC2_47: ADC2.47(DRDY#) ; port DRDY_ADC_B
NetADC2_52: ADC2.52(CLKSEL) JM7.1 JM8.2
NetJM13_2: JM15.1 ; port TO_DAISY_IN_A

Not connected (* = marked no-connect by the designer): ADC2 17(PO1)* 18(PO2)* 27(NC)* 29(NC)* 42(GPIO1)* 44(GPIO2)* 45(GPIO3)* 46(GPIO4)* 60(RLDREF)* 61(RLDINV)* 62(RLDIN)* 63(RLDOUT)*; PEL2 4*

### Buses and harness runs
harness SPIM = port SPIM

### Notes on the sheet
- AFE BYPASS
- CLOSE TO PINS!
- 2CS/Daisy Chain select
- (in symbol uJumper) uJmr

### Library data of the parts
CC18-CC34 = Cap Semi: Capacitor (Semiconductor SIM Model); Published: 8-Jun-2000; LatestRevisionDate: 29-May-2009; LatestRevisionNote: IPC-7351 Footprint Added.; PackageReference: C1206; Publisher: Altium Limited; PackageDescription: Chip Capacitor
  CC23: Value: 100nF
  CC24: Value: 1uF
R10 = Res3: Resistor; Published: 8-Jun-2000; LatestRevisionDate: 29-May-2009; LatestRevisionNote: IPC-7351 Footprint Added.; PackageReference: J1-0603; Publisher: Altium Limited; PackageDescription: Chip Resistor; Value: NC

## Sheet 05_POWER.SchDoc: WMI (POWER)
size A4
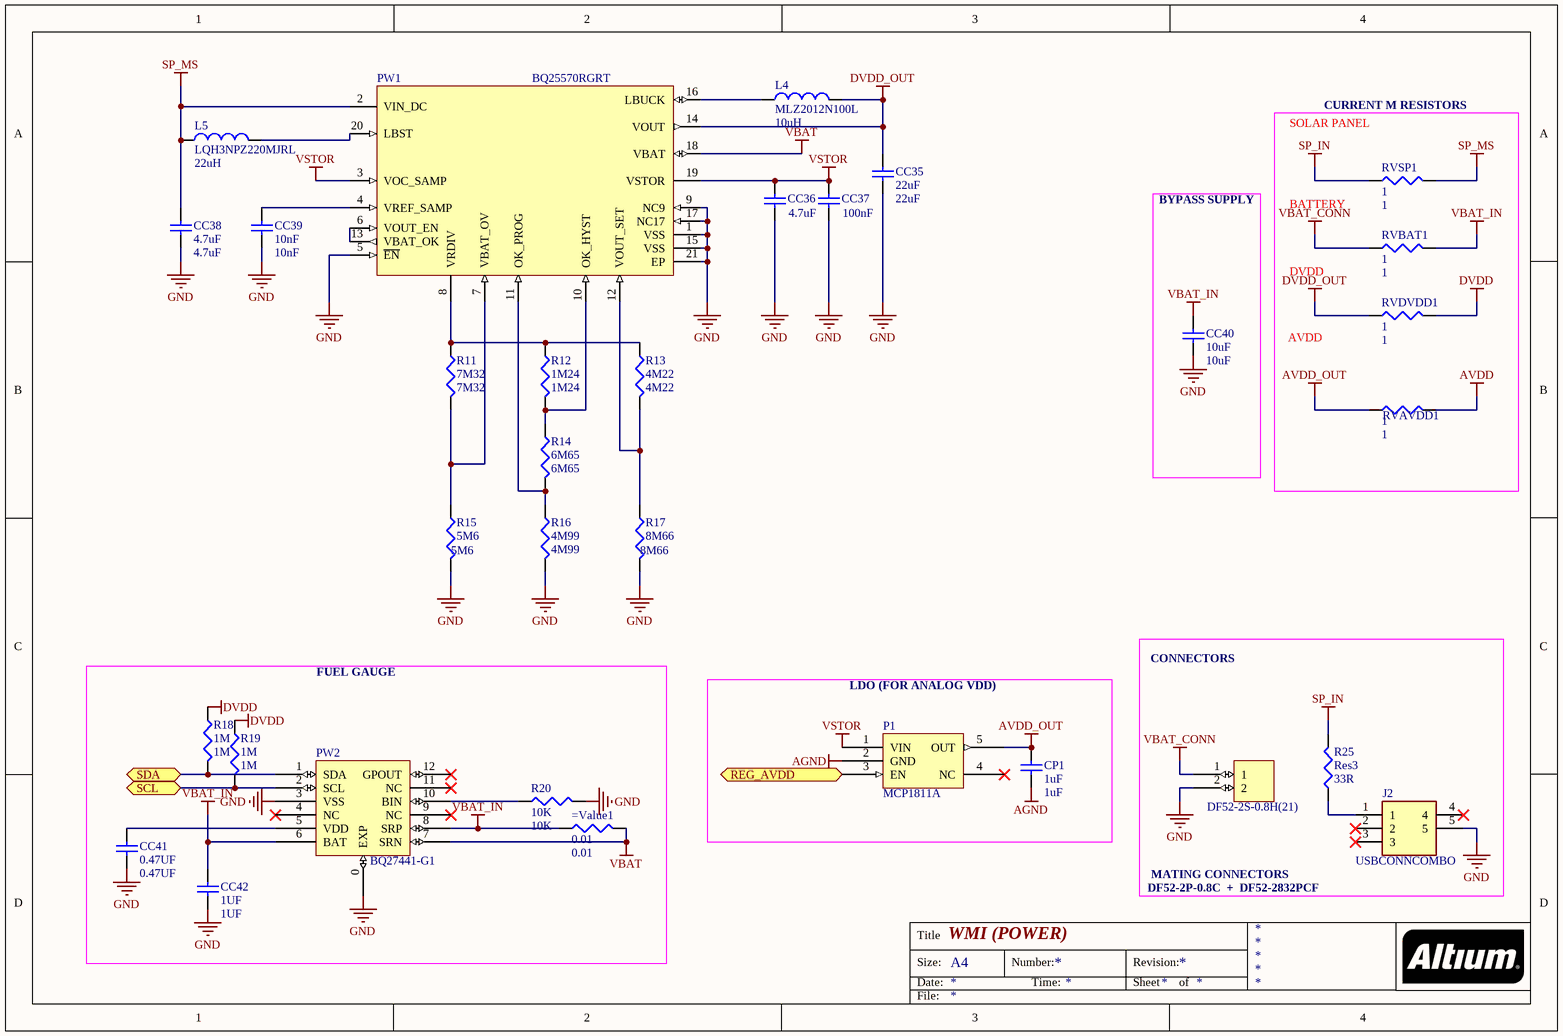
[diagram p5: 05_POWER.SchDoc]

### Parts
=Value1  0.01  [0402]
CC35  22uF  [J1-0603]
CC36  4.7uF  [0402]
CC37  100nF  [0603]
CC38  4.7uF  [0402]
CC39  10nF  [J1-0603]
CC40  10uF  [0402]
CC41  0.47UF  [0402]
CC42  1UF  [0402]
CONN_BAT1  DF52-2S-0.8H(21)  [DF52-2S-0.8H(21)]
CP1  1uF  [0402]
J2  USBCONNCOMBO  [MICRO-USB(2.0-SMT-TYPE-B) Combo 3D]
L4  MLZ2012N100L  value 10uH  [6-0805_N]
L5  LQH3NPZ220MJRL  value 22uH  [1212_PCK]
P1  MCP1811A  [UJ-5_N]
PW1  BQ25570RGRT  [VQFN20]
PW2  BQ27441-G1  [DRZ12_SMALL]
R11  7M32  [0402]
R12  1M24  [0402]
R13  4M22  [0402]
R14  6M65  [0402]
R15  5M6  [0402]
R16  4M99  [0402]
R17  8M66  [0402]
R18  1M  [0402]
R19  1M  [0402]
R20  10K  [0402]
R25  Res3  value 33R  [J1-0603]
RVAVDD1  1  [J1-0603]
RVBAT1  1  [J1-0603]
RVDVDD1  1  [J1-0603]
RVSP1  1  [J1-0603]

### Blocks framed on the sheet
CURRENT M RESISTORS: RVAVDD1 RVBAT1 RVDVDD1 RVSP1
BYPASS SUPPLY: CC40
FUEL GAUGE: =Value1 CC41 CC42 PW2 R18-R20
LDO (FOR ANALOG VDD): CP1 P1

### Ports
REG_AVDD (in), SCL (bidir), SDA (bidir)

### Nets
AGND: CP1.1 P1.2(GND)
AVDD: RVAVDD1.2
AVDD_OUT: CP1.2 P1.5(OUT) RVAVDD1.1
DVDD: R18.1 R19.1 RVDVDD1.2
DVDD_OUT: CC35.2 L4.2 PW1.14(VOUT) RVDVDD1.1
GND: CC35.1 CC36.1 CC37.1 CC38.1 CC39.1 CC40.1 CC41.1 CC42.1 CONN_BAT1.2 J2.5 PW1.1(VSS) PW1.5(~{EN}) PW1.9(NC9) PW1.15(VSS) PW1.17(NC17) PW1.21(EP) PW2.0(EXP) PW2.3(VSS) R15.2 R16.2 R17.2 R20.2  [project net DGND]
SP_IN: R25.2 RVSP1.1
SP_MS: CC38.2 L5.1 PW1.2(VIN_DC) RVSP1.2
VBAT: =Value1.2 PW1.18(VBAT) PW2.7(SRN)
VBAT_CONN: CONN_BAT1.1 RVBAT1.1
VBAT_IN: =Value1.1 CC40.2 CC42.2 PW2.6(BAT) PW2.8(SRP) RVBAT1.2
VSTOR: CC36.2 CC37.2 P1.1(VIN) PW1.3(VOC_SAMP) PW1.19(VSTOR)
P0.26: P1.3(EN) ; port REG_AVDD
P0.30/AIN6: PW2.1(SDA) R18.2 ; port SDA
P0.31/AIN7: PW2.2(SCL) R19.2 ; port SCL
NetCC39_2: CC39.2 PW1.4(VREF_SAMP)
NetCC41_2: CC41.2 PW2.5(VDD)
NetJ2_1: J2.1 R25.1
NetL4_1: L4.1 PW1.16(LBUCK)
NetL5_2: L5.2 PW1.20(LBST)
NetPW1_6: PW1.6(VOUT_EN) PW1.13(VBAT_OK)
NetPW1_7: PW1.7(VBAT_OV) R11.2 R15.1
NetPW1_8: PW1.8(VRDIV) R11.1 R12.1 R13.1
NetPW1_10: PW1.10(OK_HYST) R12.2 R14.1
NetPW1_11: PW1.11(OK_PROG) R14.2 R16.1
NetPW1_12: PW1.12(VOUT_SET) R13.2 R17.1
NetPW2_10: PW2.10(BIN) R20.1

Not connected (* = marked no-connect by the designer): J2 2* 3* 4*; P1 4(NC)*; PW2 4(NC)* 9(NC)* 11(NC)* 12(GPOUT)*

### Notes on the sheet
- (near RVSP1) SOLAR PANEL
- (near RVSP1) BATTERY
- (near RVBAT1) DVDD
- (near RVDVDD1) AVDD
- CONNECTORS
- MATING CONNECTORS
- DF52-2P-0.8C  +  DF52-2832PCF
- Title
- Size:
- Date:
- A4
- Number:
- Time:
- Revision:
- Sheet
- of
- File:

### Library data of the parts
=Value1 R11-R20 R25 RVAVDD1 RVBAT1 RVDVDD1 RVSP1 = Res3: Resistor; Published: 8-Jun-2000; LatestRevisionDate: 29-May-2009; LatestRevisionNote: IPC-7351 Footprint Added.; PackageReference: J1-0603; Publisher: Altium Limited; PackageDescription: Chip Resistor
  =Value1: Value: 0.01
  R11: Value: 7M32
  R12: Value: 1M24
  R13: Value: 4M22
  R14: Value: 6M65
  R15: Value: 5M6
  R16: Value: 4M99
  R17: Value: 8M66
  R18 R19: Value: 1M
  R20: Value: 10K
  RVAVDD1 RVBAT1 RVDVDD1 RVSP1: Value: 1
CC35-CC42 CP1 = Cap Semi: Capacitor (Semiconductor SIM Model); Published: 8-Jun-2000; LatestRevisionDate: 29-May-2009; LatestRevisionNote: IPC-7351 Footprint Added.; PackageReference: C1206; Publisher: Altium Limited; PackageDescription: Chip Capacitor
  CC35: Value: 22uF
  CC36 CC38: Value: 4.7uF
  CC37: Value: 100nF
  CC39: Value: 10nF
  CC40: Value: 10uF
  CC41: Value: 0.47UF
  CC42: Value: 1UF
  CP1: Value: 1uF
J2 = 629105136821: Connector; Manufacturer_Name: Wurth Elektronik; Datasheet Link: https://componentsearchengine.com/Datasheets/1/629105136821.pdf; Mouser2 Part Number: 710-629105136821; Mouser2 Price/Stock: https://www.mouser.com/Search/Refine.aspx?Keyword=710-629105136821; Manufacturer_Part_Number: 629105136821
L4 L5 = Inductor: Code_IEC: 1005; Published: 8-Jun-2000; LatestRevisionDate: 29-May-2009; LatestRevisionNote: IPC-7351 Footprint Added.; PackageReference: 0402-A; Publisher: Altium Limited; PackageDescription: Chip Inductor; Code_JEITA: 0402
P1 = MCP1811A: Regulator
PW1 = BQ25570RGRT: IC ENERGY HARV CTRLR BATT 20VQFN; Manufacturer: Texas Instruments; Current - Supply: 488nA; Voltage - Supply: 0.12 V ~ 4 V; Packaging: Tape & Reel (TR); Applications: Energy Harvesting; Operating Temperature: -40°C ~ 125°C; Mounting Type: Surface Mount; Package / Case: 20-VFQFN Exposed Pad; Supplier Device Package: 20-VQFN (3.5x3.5); P/N: BQ25570RGRT; Supplier: Digi-Key; Supplier Part Number: 296-37014-2-ND; ComponentLink1Description: bq25570.pdf; ComponentLink1URL: http://www.ti.com/lit/ds/symlink/bq25570.pdf

## Sheet 06_SENSORS.SchDoc
size A
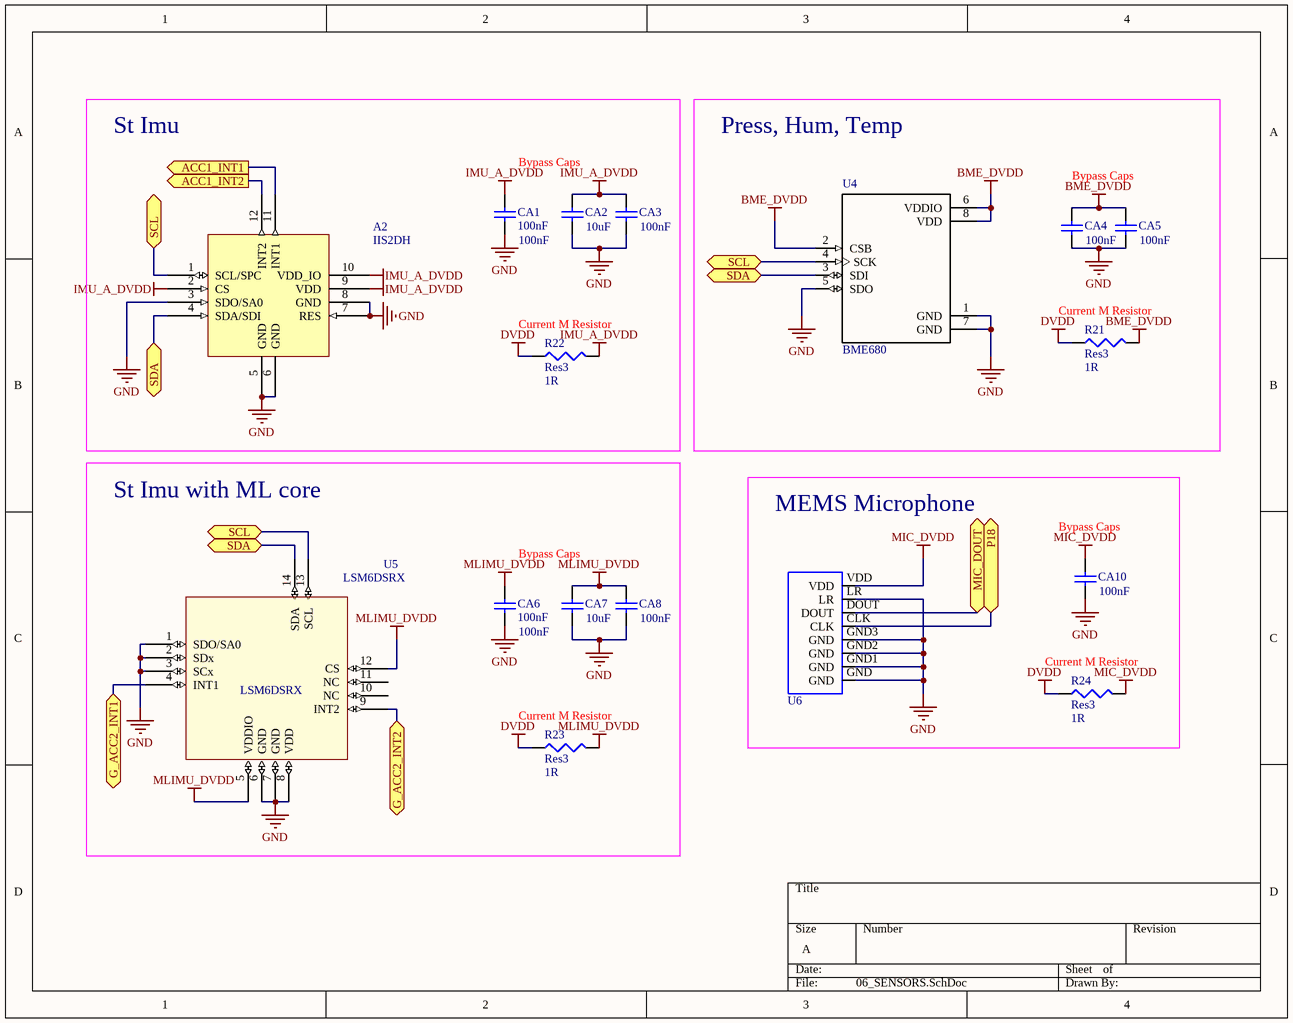
[diagram p6: 06_SENSORS.SchDoc]

### Parts
(Parts that share a designator on the sheet are numbered #1, #2 ... from top to bottom, then left to right.)
A2  IIS2DH  [*LGA12R50P4X4_200X200X86]
CA1  100nF  [0402]
CA2  10uF  [0402]
CA3  100nF  [0402]
CA4  100nF  [0402]
CA5  100nF  [0402]
CA6  100nF  [0402]
CA7  10uF  [0402]
CA8  100nF  [0402]
CA10  100nF  [0402]
R21  Res3  value 1R  [0402]
R22#2  Res3  value 1R  [0402]
R23  Res3  value 1R  [0402]
R24  Res3  value 1R  [0402]
U4  BME680  [*PSON80P300X300X100-8N]
U5  LSM6DSRX  [*PQFN50P300X250X86-14N]
U6  MP34DT05-A  [MIC-PACK_MP34DT05-A(Primary)]  (value not drawn)

### Blocks framed on the sheet
St Imu: A2 CA1-CA3 R22#2
Press, Hum, Temp: CA4 CA5 R21 U4
St Imu with ML core: CA6-CA8 R23 U5
MEMS Microphone: CA10 R24 U6

### Ports
ACC1_INT1 (out), ACC1_INT2 (out), G_ACC2_INT1 (bidir), G_ACC2_INT2 (bidir), MIC_DOUT (bidir), P18, SCL, SDA

### Nets
BME_DVDD: CA4.2 CA5.2 R21.2 U4.2(CSB) U4.6(VDDIO) U4.8(VDD)
DVDD: R21.1 R22#2.1 R23.1 R24.1
GND: A2.3(SDO/SA0) A2.5(GND) A2.6(GND) A2.7(RES) A2.8(GND) CA1.1 CA2.1 CA3.1 CA4.1 CA5.1 CA6.1 CA7.1 CA8.1 CA10.1 U4.1(GND) U4.5(SDO) U4.7(GND) U5.1(SDO/SA0) U5.2(SDx) U5.3(SCx) U5.6(GND) U5.7(GND) U5.8(VDD) U6.GND U6.GND1(GND) U6.GND2(GND) U6.GND3(GND) U6.LR  [project net DGND]
IMU_A_DVDD: A2.2(CS) A2.9(VDD) A2.10(VDD_IO) CA1.2 CA2.2 CA3.2 R22#2.2
MIC_DVDD: CA10.2 R24.2 U6.VDD
MLIMU_DVDD: CA6.2 CA7.2 CA8.2 R23.2 U5.5(VDDIO) U5.12(CS)
P0.07: A2.11(INT1) ; port ACC1_INT1
P0.08: A2.12(INT2) ; port ACC1_INT2
P0.25: U6.CLK ; port P18
P0.27: U6.DOUT ; port MIC_DOUT
P0.30/AIN6: A2.4(SDA/SDI) U4.3(SDI) U5.14(SDA) ; port SDA
P0.31/AIN7: A2.1(SCL/SPC) U4.4(SCK) U5.13(SCL) ; port SCL
NetJM11_2: U5.4(INT1) ; port G_ACC2_INT1
NetJM18_2: U5.9(INT2) ; port G_ACC2_INT2

Not connected (* = marked no-connect by the designer): U5 10(NC) 11(NC)

### Notes on the sheet
- Bypass Caps
- (near R22#2) Current M Resistor
- (near R21) Current M Resistor
- (near CA10) Bypass Caps
- (near R24) Current M Resistor
- (near R23) Current M Resistor

### Library data of the parts
CA1-CA8 CA10 = Cap Semi: Capacitor (Semiconductor SIM Model); Published: 8-Jun-2000; LatestRevisionDate: 29-May-2009; LatestRevisionNote: IPC-7351 Footprint Added.; PackageReference: C1206; Publisher: Altium Limited; PackageDescription: Chip Capacitor
  CA1 CA3-CA6 CA8 CA10: Value: 100nF
  CA2 CA7: Value: 10uF
R21 R22#2 R23 R24 = Res3: Resistor; Published: 8-Jun-2000; LatestRevisionDate: 29-May-2009; LatestRevisionNote: IPC-7351 Footprint Added.; PackageReference: J1-0603; Publisher: Altium Limited; PackageDescription: Chip Resistor
U4 = BME680: Integrated Environmental Unit; MF: Bosch Sensortec; SnapEDA_Link: https://www.snapeda.com/parts/BME680/Bosch%20Sensortec/view-part/?ref=snap; MP: BME680; Availability: Unavailable; Price: None; Package: LGA-8 Bosch Tools; Value: *
U6 = MP34DT05-A: Mic Omni-Directional -26dB 3.6Vdc Rectangular Solder Pad; MF: STMicroelectronics; MP: MP34DT05-A; Package: None; Availability: Unavailable; SnapEDA_Link: https://www.snapeda.com/parts/MP34DT05-A/STMicroelectronics/view-part/?ref=snap; Price: None; Value: *

## Nets that join several sheets
AGND: 03_ANALOG_A (28 pins), 04_ANALOG_B (24 pins), 05_POWER (CP1.1 P1.2)
AVDD: 03_ANALOG_A (13 pins), 04_ANALOG_B (14 pins), 05_POWER (RVAVDD1.2)
DGND: 01_MRWOLF (18 pins), 02_NRF52832 (29 pins), 03_ANALOG_A (7 pins), 04_ANALOG_B (7 pins), 05_POWER (22 pins), 06_SENSORS (28 pins)
DVDD: 01_MRWOLF (16 pins), 02_NRF52832 (7 pins), 03_ANALOG_A (7 pins), 04_ANALOG_B (7 pins), 05_POWER (R18.1 R19.1 RVDVDD1.2), 06_SENSORS (R21.1 R22#2.1 R23.1 R24.1)
ADC_A_REF1.5V: 03_ANALOG_A (CC17.2 PEL1.3 R8.2 R9.2), 04_ANALOG_B (PEL2.3)
CS_nRF#: 01_MRWOLF (U1.36), 02_NRF52832 (U2.16)
IN_CS_ADC_A: 01_MRWOLF (U1.38), 02_NRF52832 (U2.15), 03_ANALOG_A (ADC1.39 R5.1), 04_ANALOG_B (JM17.2)
IN_CS_ADC_B: 01_MRWOLF (U1.28), 02_NRF52832 (U2.40), 04_ANALOG_B (ADC2.39 JM17.1 R10.1)
JTAG.~{TRST}: 01_MRWOLF (PJ1.7 U1.48), 02_NRF52832 (U2.4)
JTAG.TCK: 01_MRWOLF (PJ1.3 U1.44), 02_NRF52832 (U2.8)
JTAG.TDI: 01_MRWOLF (PJ1.6 U1.47), 02_NRF52832 (U2.5)
JTAG.TDO: 01_MRWOLF (PJ1.5 U1.46), 02_NRF52832 (U2.6)
JTAG.TMS: 01_MRWOLF (PJ1.4 U1.45), 02_NRF52832 (U2.7)
MISO: 01_MRWOLF (U1.33), 02_NRF52832 (U2.17), 03_ANALOG_A (ADC1.43), 04_ANALOG_B (JM14.1)
MOSI: 01_MRWOLF (U1.31), 02_NRF52832 (U2.18), 03_ANALOG_A (ADC1.34), 04_ANALOG_B (JM16.2)
NetADC2_35: 02_NRF52832 (JM6.2 R26.1 U2.27), 04_ANALOG_B (ADC2.35)
NetADC2_37: 03_ANALOG_A (RJ2.2), 04_ANALOG_B (ADC2.37)
NetADC2_47: 02_NRF52832 (JM5.2), 04_ANALOG_B (ADC2.47)
NetJM11_2: 01_MRWOLF (JM19.2), 02_NRF52832 (JM11.2), 06_SENSORS (U5.4)
NetJM13_2: 03_ANALOG_A (JM13.2), 04_ANALOG_B (JM15.1)
NetJM18_2: 01_MRWOLF (JM20.2), 02_NRF52832 (JM18.2), 06_SENSORS (U5.9)
P0.07: 01_MRWOLF (JM3.2), 02_NRF52832 (U2.9), 06_SENSORS (A2.11)
P0.08: 01_MRWOLF (JM4.2), 02_NRF52832 (U2.10), 06_SENSORS (A2.12)
P0.11: 02_NRF52832 (U2.14), 03_ANALOG_A (ADC1.47)
P0.17: 02_NRF52832 (JM6.1 R4.1 U2.20), 03_ANALOG_A (ADC1.35)
P0.18: 02_NRF52832 (U2.21), 03_ANALOG_A (R6.1)
P0.19: 01_MRWOLF (U1.17), 02_NRF52832 (U2.22)
P0.20: 01_MRWOLF (U1.18), 02_NRF52832 (U2.23)
P0.24: 01_MRWOLF (U1.19), 02_NRF52832 (U2.29), 03_ANALOG_A (ADC1.38), 04_ANALOG_B (ADC2.38)
P0.25: 01_MRWOLF (JM10.2), 02_NRF52832 (U2.37), 06_SENSORS (U6.CLK)
P0.26: 02_NRF52832 (U2.38), 05_POWER (P1.3)
P0.27: 01_MRWOLF (JM9.2), 02_NRF52832 (U2.39), 06_SENSORS (U6.DOUT)
P0.29/AIN5: 01_MRWOLF (PJ1.8 R1.1 U1.60), 02_NRF52832 (R22#1.1 U2.41)
P0.30/AIN6: 01_MRWOLF (JM1.2), 02_NRF52832 (U2.42), 05_POWER (PW2.1 R18.2), 06_SENSORS (A2.4 U4.3 U5.14)
P0.31/AIN7: 01_MRWOLF (JM2.2), 02_NRF52832 (U2.43), 05_POWER (PW2.2 R19.2), 06_SENSORS (A2.1 U4.4 U5.13)
SCK: 01_MRWOLF (U1.30), 02_NRF52832 (U2.19), 03_ANALOG_A (ADC1.40), 04_ANALOG_B (ADC2.40)